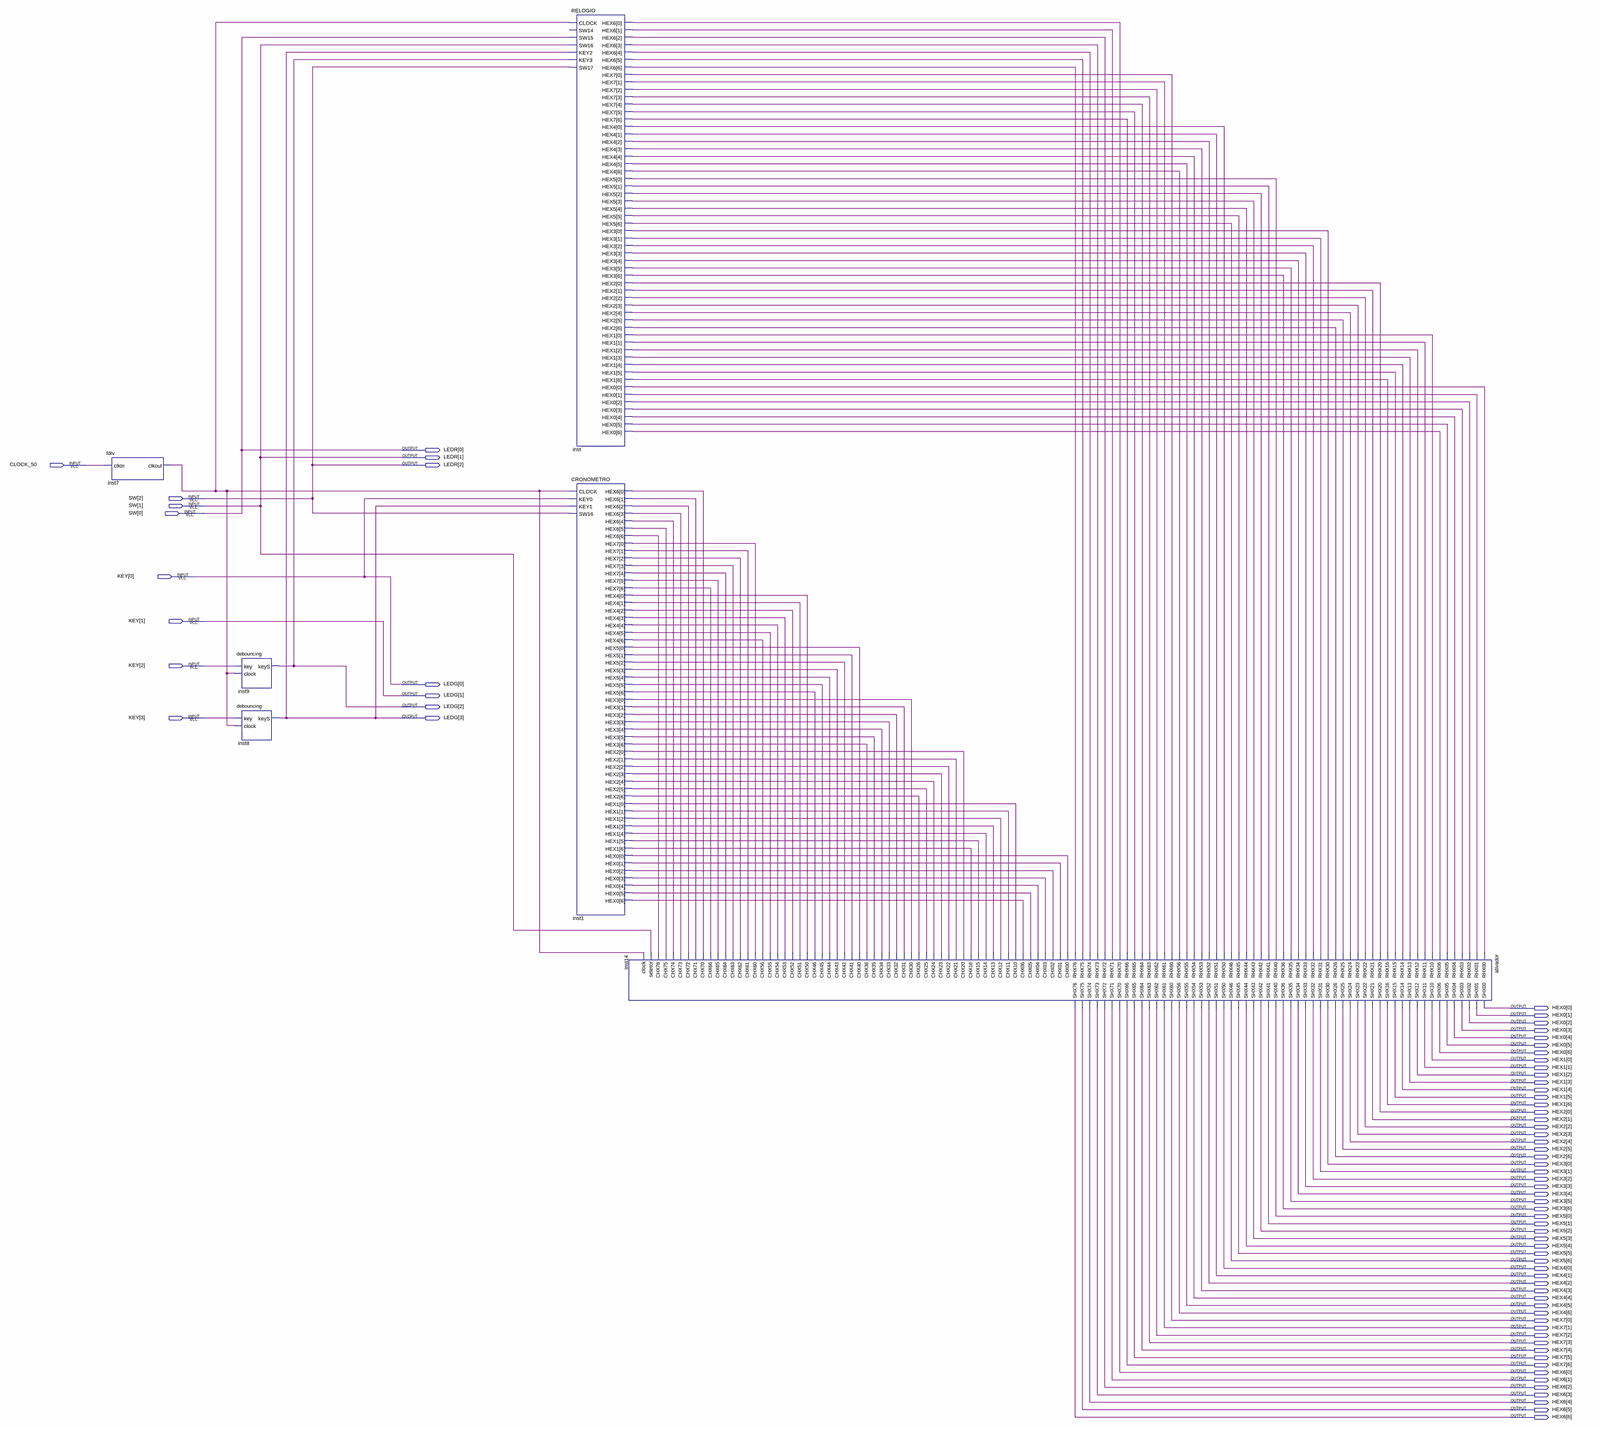
[diagram p0: schematic sheet, whole]
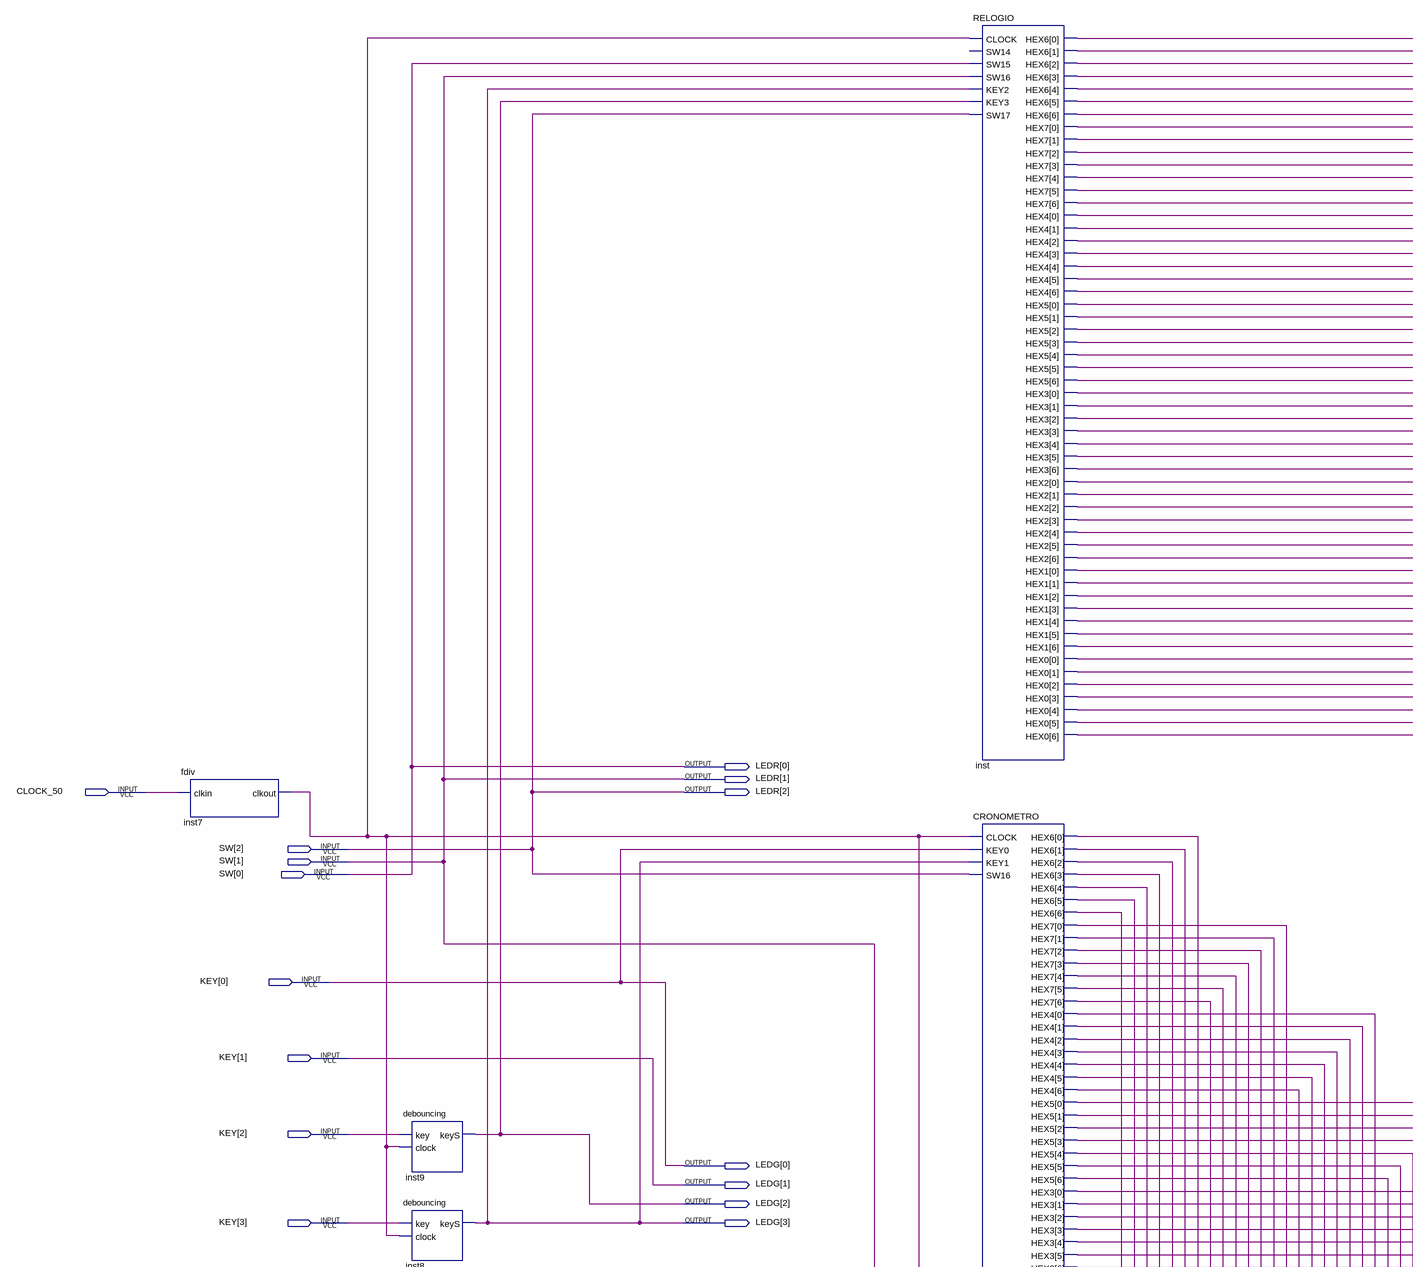
[diagram p1: schematic sheet, upper left part]
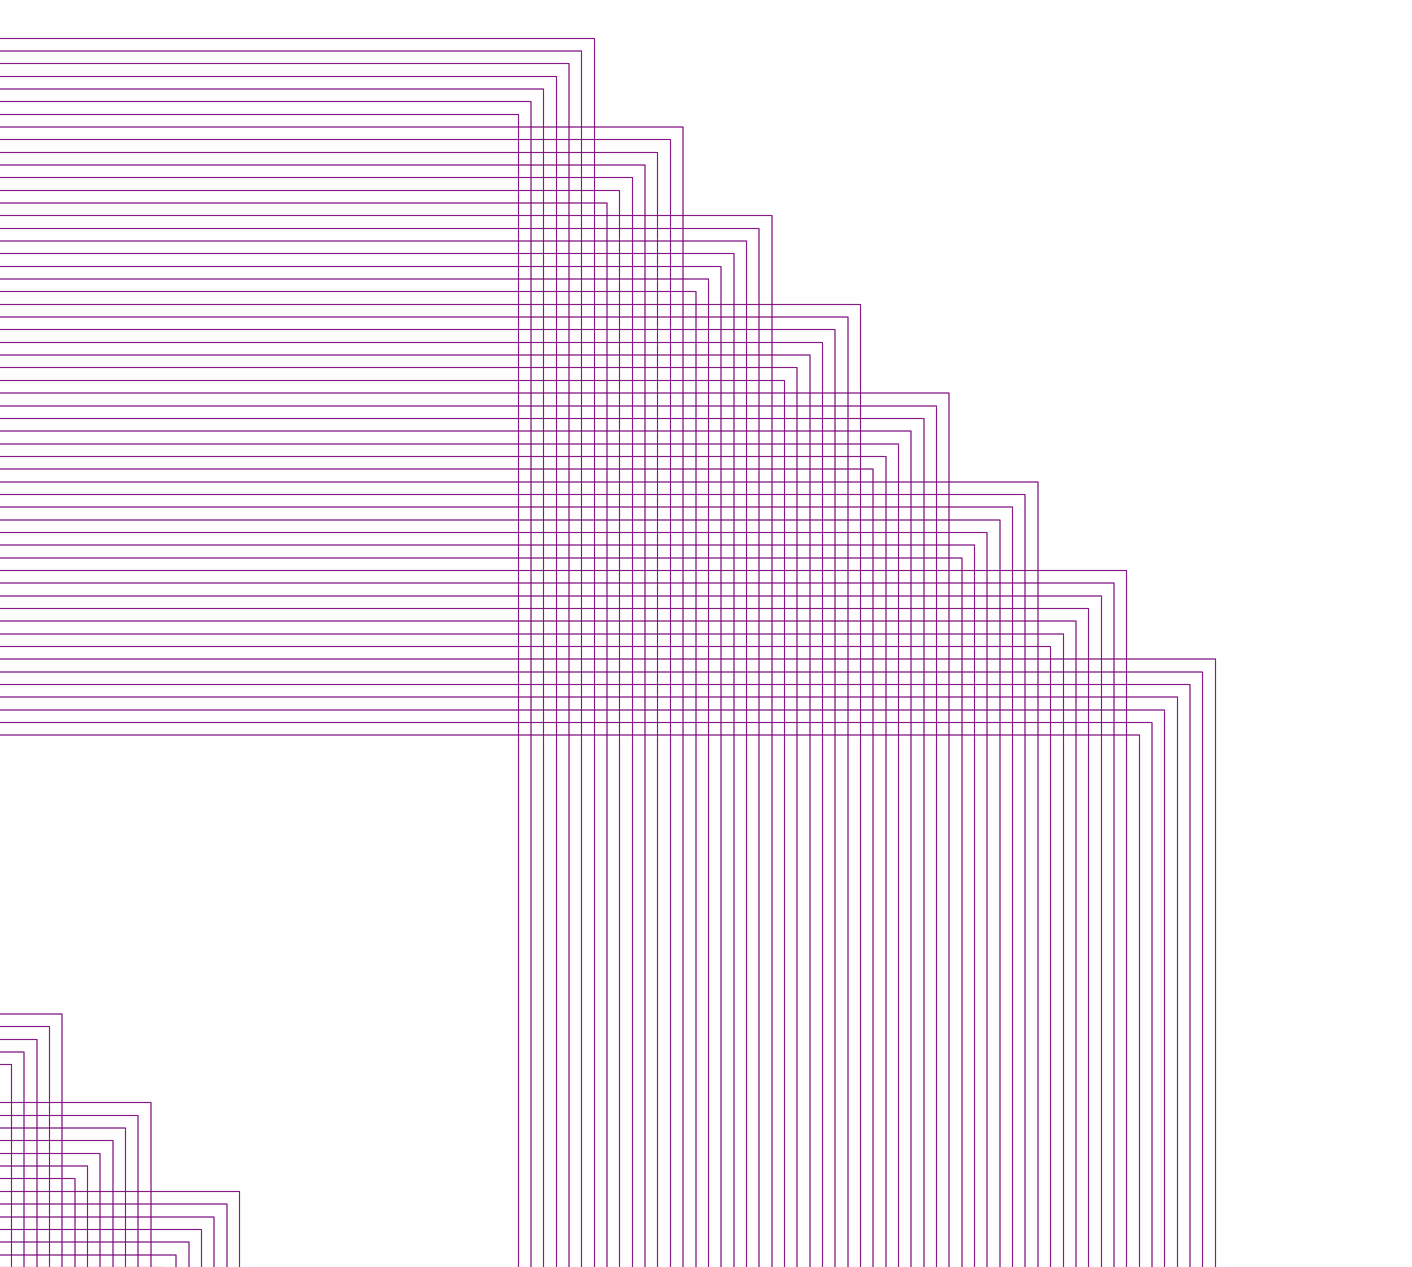
[diagram p2: schematic sheet, upper right part]
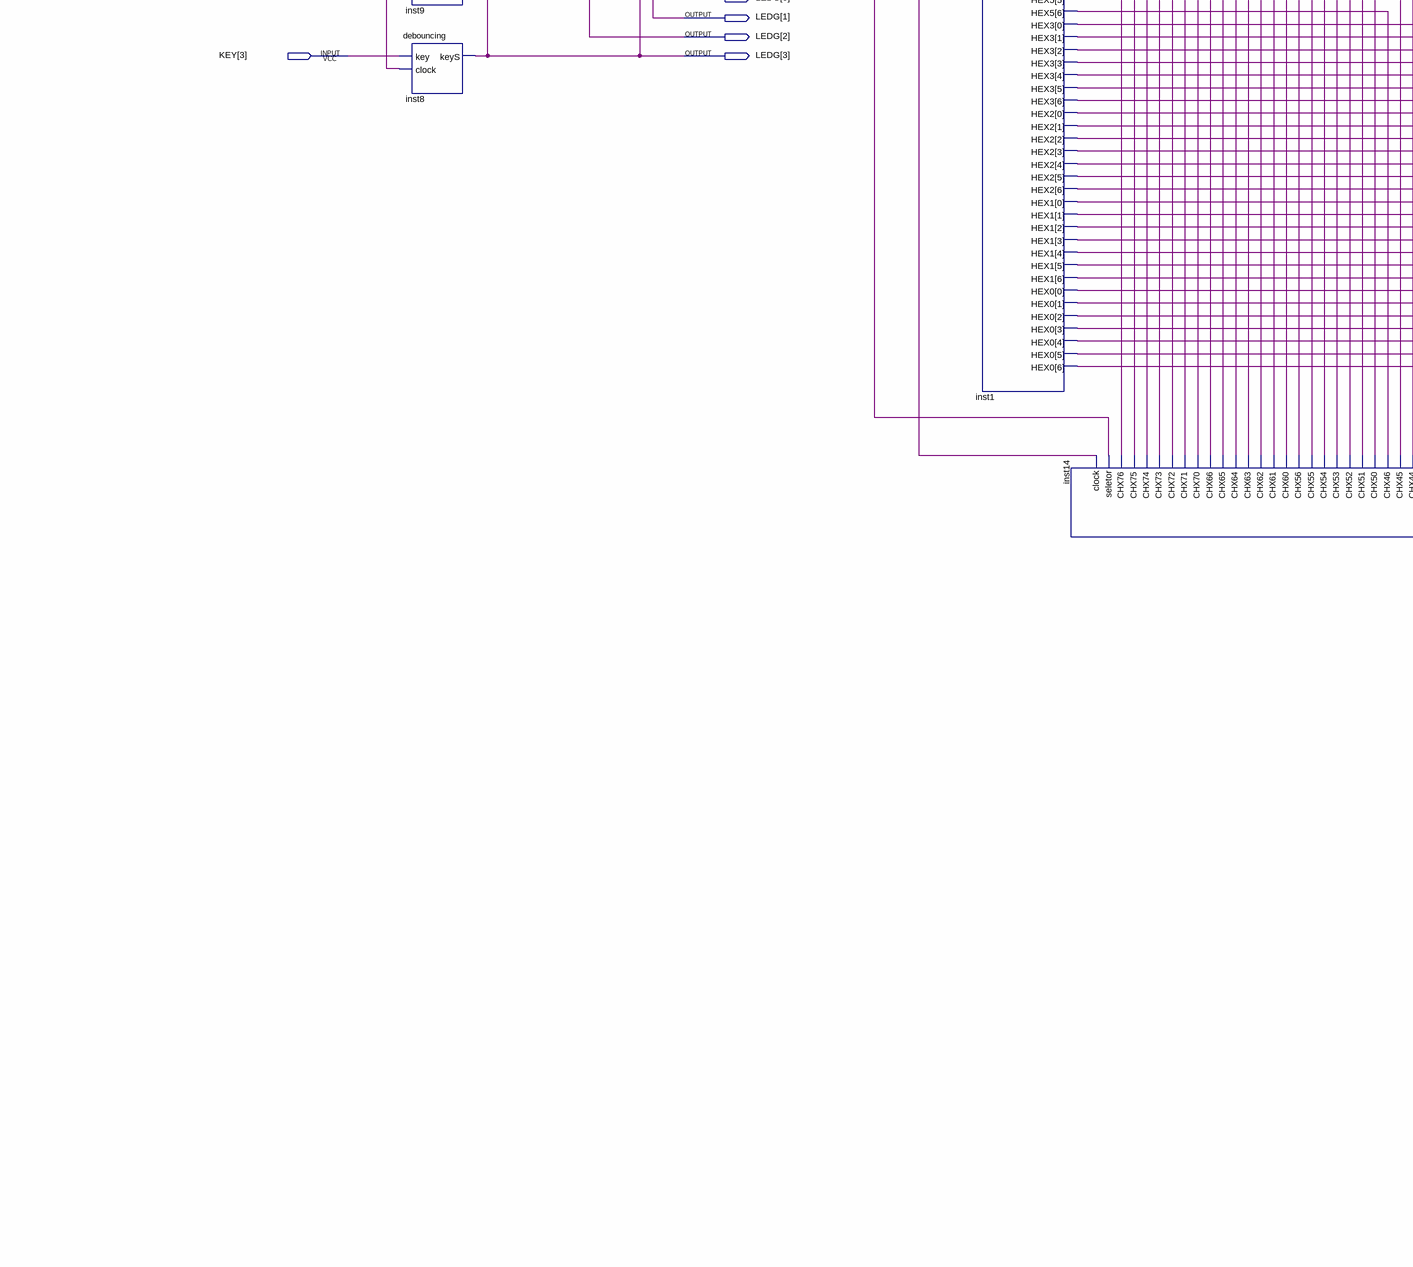
[diagram p3: schematic sheet, lower left part]
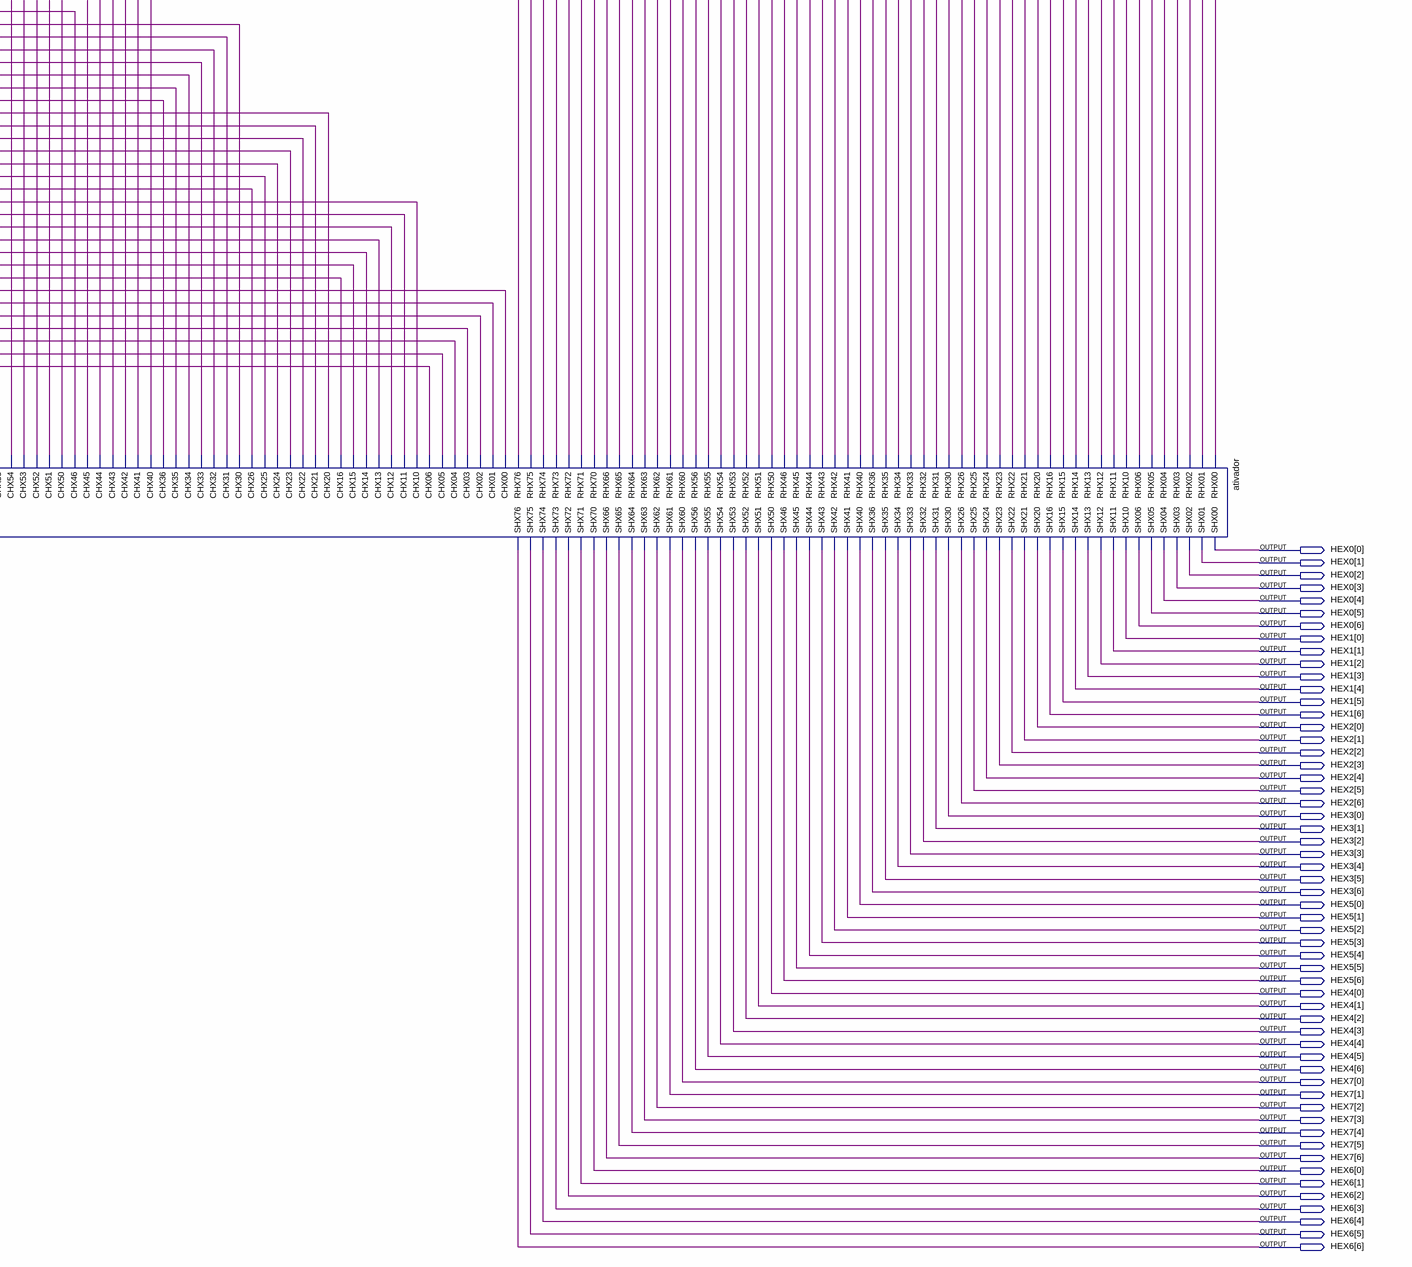
[diagram p4: schematic sheet, lower right part]
// Quartus schematic projeto.bdf as structural Verilog: 6 symbols, 71 pins
module projeto (
  input  CLOCK_50,
  input  [2:0] SW,
  input  [3:0] KEY,
  output [2:0] LEDR,
  output [3:0] LEDG,
  output [6:0] HEX0,
  output [6:0] HEX1,
  output [6:0] HEX2,
  output [6:0] HEX3,
  output [6:0] HEX5,
  output [6:0] HEX4,
  output [6:0] HEX7,
  output [6:0] HEX6
);

  wire inst1_hex0, inst1_hex0_2, inst1_hex0_3, inst1_hex0_4, inst1_hex0_5, inst1_hex0_6, inst1_hex0_7,
       inst1_hex1, inst1_hex1_2, inst1_hex1_3, inst1_hex1_4, inst1_hex1_5, inst1_hex1_6, inst1_hex1_7,
       inst1_hex2, inst1_hex2_2, inst1_hex2_3, inst1_hex2_4, inst1_hex2_5, inst1_hex2_6, inst1_hex2_7,
       inst1_hex3, inst1_hex3_2, inst1_hex3_3, inst1_hex3_4, inst1_hex3_5, inst1_hex3_6, inst1_hex3_7,
       inst1_hex4, inst1_hex4_2, inst1_hex4_3, inst1_hex4_4, inst1_hex4_5, inst1_hex4_6, inst1_hex4_7,
       inst1_hex5, inst1_hex5_2, inst1_hex5_3, inst1_hex5_4, inst1_hex5_5, inst1_hex5_6, inst1_hex5_7,
       inst1_hex6, inst1_hex6_2, inst1_hex6_3, inst1_hex6_4, inst1_hex6_5, inst1_hex6_6, inst1_hex6_7,
       inst1_hex7, inst1_hex7_2, inst1_hex7_3, inst1_hex7_4, inst1_hex7_5, inst1_hex7_6, inst1_hex7_7,
       inst7_clkout, inst_hex0, inst_hex0_2, inst_hex0_3, inst_hex0_4, inst_hex0_5, inst_hex0_6, inst_hex0_7,
       inst_hex1, inst_hex1_2, inst_hex1_3, inst_hex1_4, inst_hex1_5, inst_hex1_6, inst_hex1_7, inst_hex2,
       inst_hex2_2, inst_hex2_3, inst_hex2_4, inst_hex2_5, inst_hex2_6, inst_hex2_7, inst_hex3, inst_hex3_2,
       inst_hex3_3, inst_hex3_4, inst_hex3_5, inst_hex3_6, inst_hex3_7, inst_hex4, inst_hex4_2, inst_hex4_3,
       inst_hex4_4, inst_hex4_5, inst_hex4_6, inst_hex4_7, inst_hex5, inst_hex5_2, inst_hex5_3, inst_hex5_4,
       inst_hex5_5, inst_hex5_6, inst_hex5_7, inst_hex6, inst_hex6_2, inst_hex6_3, inst_hex6_4, inst_hex6_5,
       inst_hex6_6, inst_hex6_7, inst_hex7, inst_hex7_2, inst_hex7_3, inst_hex7_4, inst_hex7_5, inst_hex7_6,
       inst_hex7_7;

  fdiv inst7 (.clkin(CLOCK_50), .clkout(inst7_clkout));
  debouncing inst9 (.key(KEY[2]), .clock(inst7_clkout), .keyS(LEDG[2]));
  debouncing inst8 (.key(KEY[3]), .clock(inst7_clkout), .keyS(LEDG[3]));
  RELOGIO inst (
    .CLOCK(inst7_clkout), .SW15(SW[0]), .SW16(SW[1]), .KEY2(LEDG[3]), .KEY3(LEDG[2]), .SW17(SW[2]),
    .HEX6({inst_hex6_3, inst_hex6_2, inst_hex6, inst_hex6_7, inst_hex6_6, inst_hex6_5, inst_hex6_4}),
    .HEX7({inst_hex7_5, inst_hex7_2, inst_hex7_7, inst_hex7_4, inst_hex7, inst_hex7_3, inst_hex7_6}),
    .HEX4({inst_hex4_3, inst_hex4_7, inst_hex4_6, inst_hex4_2, inst_hex4_5, inst_hex4_4, inst_hex4}),
    .HEX5({inst_hex5, inst_hex5_7, inst_hex5_6, inst_hex5_5, inst_hex5_4, inst_hex5_3, inst_hex5_2}),
    .HEX3({inst_hex3_5, inst_hex3_2, inst_hex3, inst_hex3_6, inst_hex3_7, inst_hex3_4, inst_hex3_3}),
    .HEX2({inst_hex2_3, inst_hex2_2, inst_hex2_7, inst_hex2_6, inst_hex2_5, inst_hex2_4, inst_hex2}),
    .HEX1({inst_hex1_7, inst_hex1_6, inst_hex1_5, inst_hex1_4, inst_hex1_3, inst_hex1_2, inst_hex1}),
    .HEX0({inst_hex0_7, inst_hex0_6, inst_hex0_5, inst_hex0_4, inst_hex0_3, inst_hex0_2, inst_hex0}));  // open: SW14
  CRONOMETRO inst1 (
    .CLOCK(inst7_clkout), .KEY0(KEY[0]), .KEY1(LEDG[3]), .SW16(SW[2]),
    .HEX6({inst1_hex6_4, inst1_hex6_3, inst1_hex6_2, inst1_hex6_7, inst1_hex6_5, inst1_hex6_6, inst1_hex6}),
    .HEX7({inst1_hex7, inst1_hex7_4, inst1_hex7_6, inst1_hex7_3, inst1_hex7_7, inst1_hex7_5, inst1_hex7_2}),
    .HEX4({inst1_hex4_2, inst1_hex4_7, inst1_hex4_6, inst1_hex4_3, inst1_hex4_4, inst1_hex4_5, inst1_hex4}),
    .HEX5({inst1_hex5_7, inst1_hex5_6, inst1_hex5_5, inst1_hex5_4, inst1_hex5_3, inst1_hex5_2, inst1_hex5}),
    .HEX3({inst1_hex3, inst1_hex3_2, inst1_hex3_3, inst1_hex3_6, inst1_hex3_7, inst1_hex3_5, inst1_hex3_4}),
    .HEX2({inst1_hex2, inst1_hex2_2, inst1_hex2_5, inst1_hex2_6, inst1_hex2_4, inst1_hex2_7, inst1_hex2_3}),
    .HEX1({inst1_hex1, inst1_hex1_2, inst1_hex1_3, inst1_hex1_4, inst1_hex1_5, inst1_hex1_6, inst1_hex1_7}),
    .HEX0({inst1_hex0_2, inst1_hex0_3, inst1_hex0_4, inst1_hex0_5, inst1_hex0_6, inst1_hex0_7, inst1_hex0}));
  ativador inst14 (
    .RHX00(inst_hex0), .RHX01(inst_hex0_2), .RHX02(inst_hex0_3), .RHX03(inst_hex0_4), .RHX04(inst_hex0_5),
    .RHX05(inst_hex0_6), .RHX06(inst_hex0_7), .RHX10(inst_hex1), .RHX11(inst_hex1_2), .RHX12(inst_hex1_3),
    .RHX13(inst_hex1_4), .RHX14(inst_hex1_5), .RHX15(inst_hex1_6), .RHX16(inst_hex1_7), .RHX20(inst_hex2),
    .RHX21(inst_hex2_4), .RHX22(inst_hex2_5), .RHX23(inst_hex2_6), .RHX24(inst_hex2_7), .RHX25(inst_hex2_2),
    .RHX26(inst_hex2_3), .RHX30(inst_hex3_3), .RHX31(inst_hex3_4), .RHX32(inst_hex3_7), .RHX33(inst_hex3_6),
    .RHX34(inst_hex3), .RHX35(inst_hex3_2), .RHX36(inst_hex3_5), .RHX40(inst_hex5_2), .RHX41(inst_hex5_3),
    .RHX42(inst_hex5_4), .RHX43(inst_hex5_5), .RHX44(inst_hex5_6), .RHX45(inst_hex5_7), .RHX46(inst_hex5),
    .RHX50(inst_hex4), .RHX51(inst_hex4_4), .RHX52(inst_hex4_5), .RHX53(inst_hex4_2), .RHX54(inst_hex4_6),
    .RHX55(inst_hex4_7), .RHX56(inst_hex4_3), .RHX60(inst_hex7_6), .RHX61(inst_hex7_3), .RHX62(inst_hex7),
    .RHX63(inst_hex7_4), .RHX64(inst_hex7_7), .RHX65(inst_hex7_2), .RHX66(inst_hex7_5), .RHX70(inst_hex6_4),
    .RHX71(inst_hex6_5), .RHX72(inst_hex6_6), .RHX73(inst_hex6_7), .RHX74(inst_hex6), .RHX75(inst_hex6_2),
    .RHX76(inst_hex6_3), .CHX00(inst1_hex0), .CHX01(inst1_hex0_7), .CHX02(inst1_hex0_6),
    .CHX03(inst1_hex0_5), .CHX04(inst1_hex0_4), .CHX05(inst1_hex0_3), .CHX06(inst1_hex0_2),
    .CHX10(inst1_hex1_7), .CHX11(inst1_hex1_6), .CHX12(inst1_hex1_5), .CHX13(inst1_hex1_4),
    .CHX14(inst1_hex1_3), .CHX15(inst1_hex1_2), .CHX16(inst1_hex1), .CHX20(inst1_hex2_3),
    .CHX21(inst1_hex2_7), .CHX22(inst1_hex2_4), .CHX23(inst1_hex2_6), .CHX24(inst1_hex2_5),
    .CHX25(inst1_hex2_2), .CHX26(inst1_hex2), .CHX30(inst1_hex3_4), .CHX31(inst1_hex3_5),
    .CHX32(inst1_hex3_7), .CHX33(inst1_hex3_6), .CHX34(inst1_hex3_3), .CHX35(inst1_hex3_2),
    .CHX36(inst1_hex3), .CHX40(inst1_hex5), .CHX41(inst1_hex5_2), .CHX42(inst1_hex5_3), .CHX43(inst1_hex5_4),
    .CHX44(inst1_hex5_5), .CHX45(inst1_hex5_6), .CHX46(inst1_hex5_7), .CHX50(inst1_hex4),
    .CHX51(inst1_hex4_5), .CHX52(inst1_hex4_4), .CHX53(inst1_hex4_3), .CHX54(inst1_hex4_6),
    .CHX55(inst1_hex4_7), .CHX56(inst1_hex4_2), .CHX60(inst1_hex7_2), .CHX61(inst1_hex7_5),
    .CHX62(inst1_hex7_7), .CHX63(inst1_hex7_3), .CHX64(inst1_hex7_6), .CHX65(inst1_hex7_4),
    .CHX66(inst1_hex7), .CHX70(inst1_hex6), .CHX71(inst1_hex6_6), .CHX72(inst1_hex6_5), .CHX73(inst1_hex6_7),
    .CHX74(inst1_hex6_2), .CHX75(inst1_hex6_3), .CHX76(inst1_hex6_4), .seletor(SW[1]), .clock(inst7_clkout),
    .SHX00(HEX0[0]), .SHX01(HEX0[1]), .SHX02(HEX0[2]), .SHX03(HEX0[3]), .SHX04(HEX0[4]), .SHX05(HEX0[5]),
    .SHX06(HEX0[6]), .SHX10(HEX1[0]), .SHX11(HEX1[1]), .SHX12(HEX1[2]), .SHX13(HEX1[3]), .SHX14(HEX1[4]),
    .SHX15(HEX1[5]), .SHX16(HEX1[6]), .SHX20(HEX2[0]), .SHX21(HEX2[1]), .SHX22(HEX2[2]), .SHX23(HEX2[3]),
    .SHX24(HEX2[4]), .SHX25(HEX2[5]), .SHX26(HEX2[6]), .SHX30(HEX3[0]), .SHX31(HEX3[1]), .SHX32(HEX3[2]),
    .SHX33(HEX3[3]), .SHX34(HEX3[4]), .SHX35(HEX3[5]), .SHX36(HEX3[6]), .SHX40(HEX5[0]), .SHX41(HEX5[1]),
    .SHX42(HEX5[2]), .SHX43(HEX5[3]), .SHX44(HEX5[4]), .SHX45(HEX5[5]), .SHX46(HEX5[6]), .SHX50(HEX4[0]),
    .SHX51(HEX4[1]), .SHX52(HEX4[2]), .SHX53(HEX4[3]), .SHX54(HEX4[4]), .SHX55(HEX4[5]), .SHX56(HEX4[6]),
    .SHX60(HEX7[0]), .SHX61(HEX7[1]), .SHX62(HEX7[2]), .SHX63(HEX7[3]), .SHX64(HEX7[4]), .SHX65(HEX7[5]),
    .SHX66(HEX7[6]), .SHX70(HEX6[0]), .SHX71(HEX6[1]), .SHX72(HEX6[2]), .SHX73(HEX6[3]), .SHX74(HEX6[4]),
    .SHX75(HEX6[5]), .SHX76(HEX6[6]));

  assign LEDG[1:0] = KEY[1:0];
  assign LEDR = SW;
endmodule
